# EAGLE design smartmeter (EAGLE 9.5.2)
CNAME: https://github.com/thomo/smartmeter; CREVISION: v1.0; DESIGNER: ThoMo
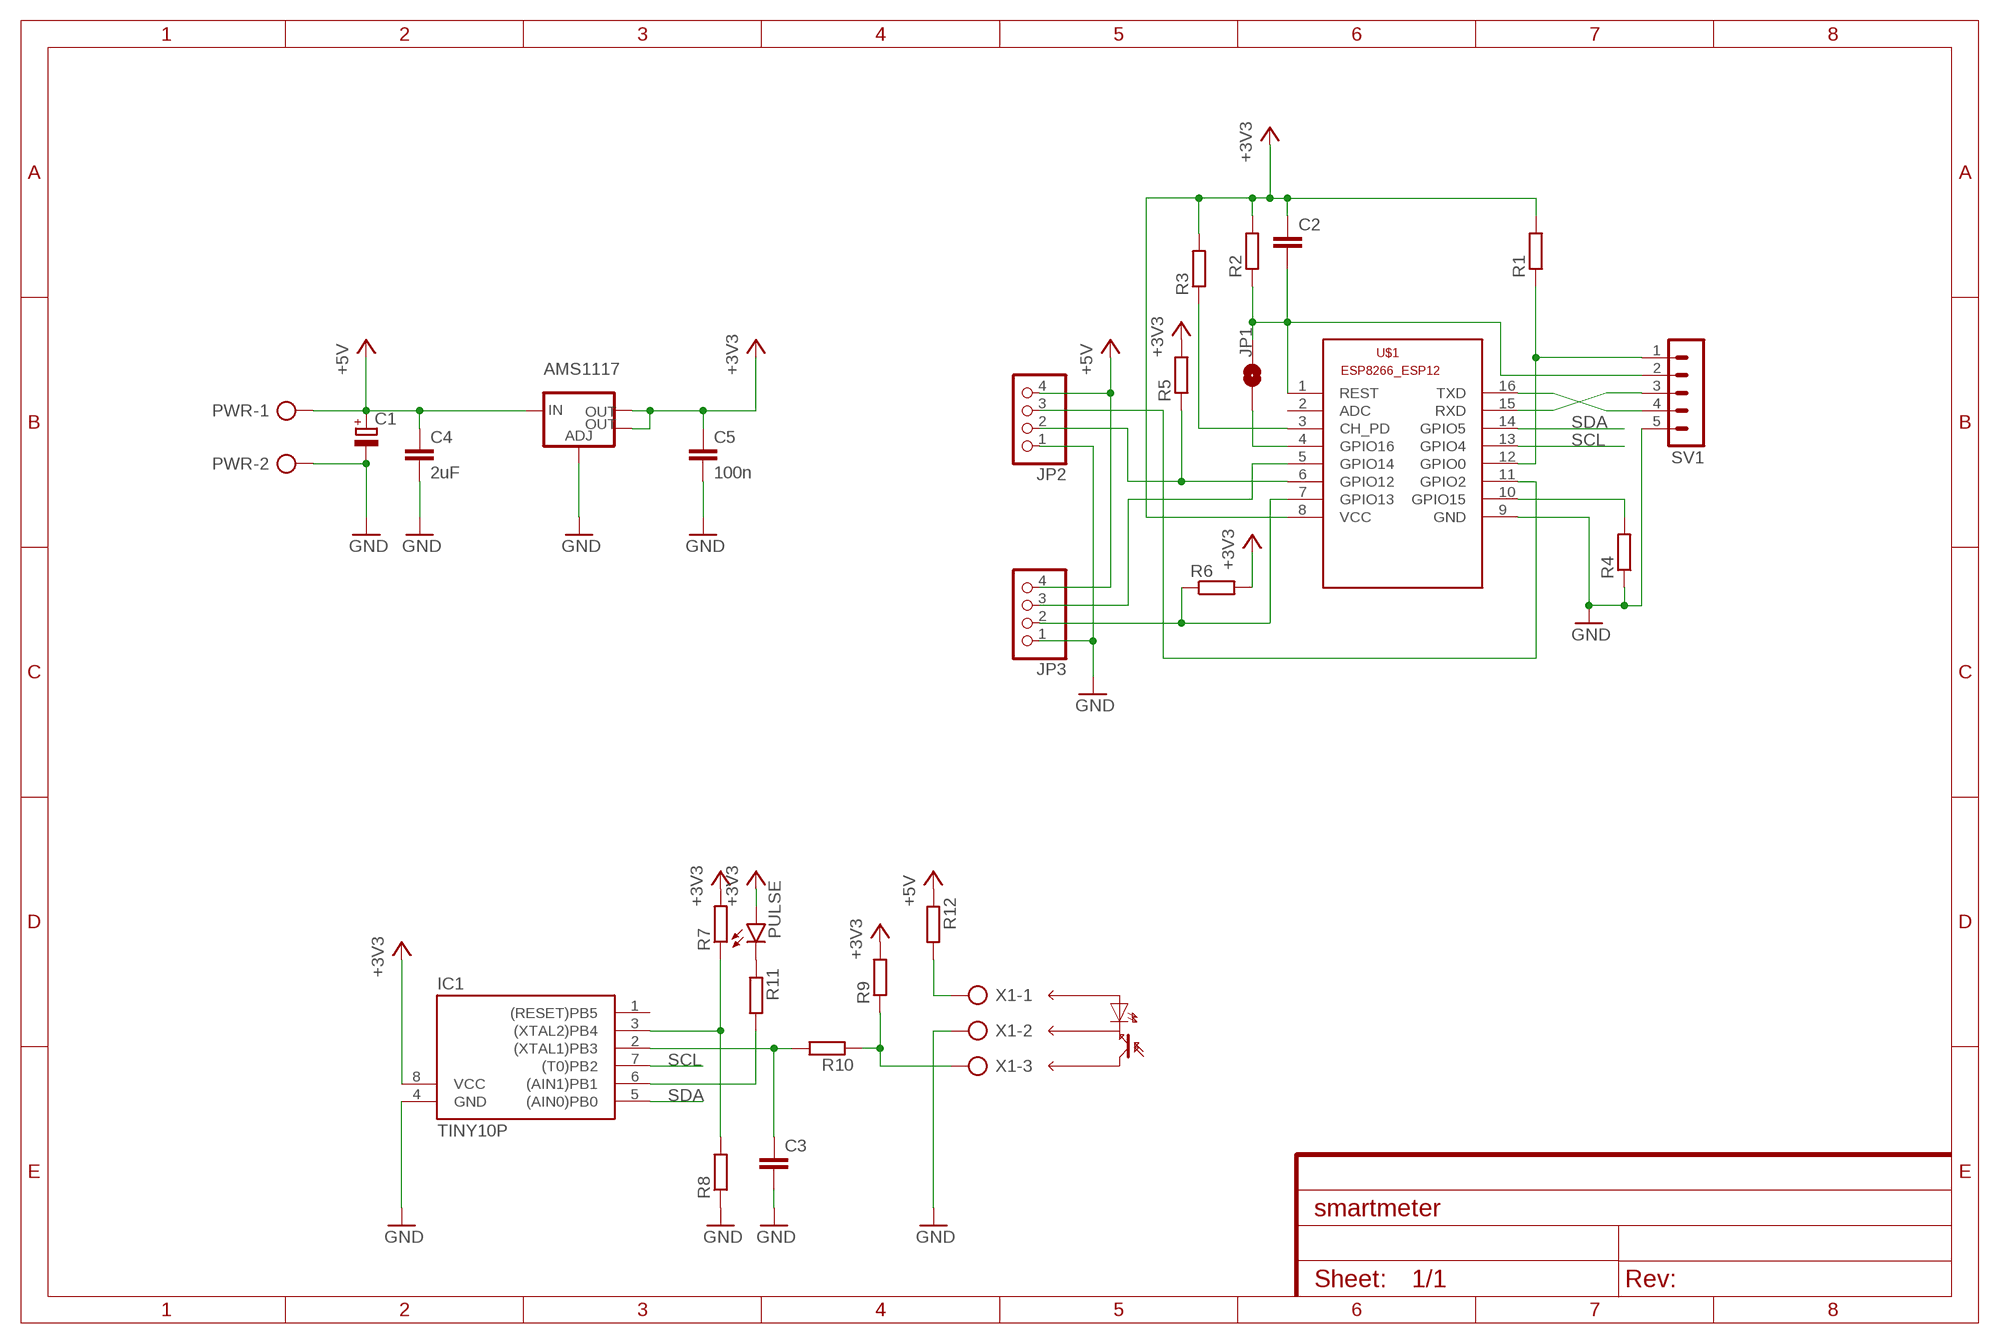
[diagram p0: schematic, sheet 1]

## Parts
AMS1117  V_REG_LM1117SOT223  [SOT223]
C1  CPOL-EUE3.5-10  [E3,5-10]
C2  C-EU050-025X075  [C050-025X075]
C3  C-EU050-025X075  [C050-025X075]
C4  2uF  C-EU025-025X050  [C025-025X050]
C5  100n  C-EU025-025X050  [C025-025X050]
IC1  TINY10P  [DIL08]
JP1  JUMPER-SMT_2_NO_SILK  [SMT-JUMPER_2_NO_SILK]
JP2  PINHD-1X4/90  [1X04/90]
JP3  PINHD-1X4/90  [1X04/90]
PULSE  LED5MM  [LED5MM]
PWR  AK500/2  [AK500/2]
R1  R-EU_0207/10  [0207/10]
R2  R-EU_0207/10  [0207/10]
R3  R-EU_0207/10  [0207/10]
R4  R-EU_0207/10  [0207/10]
R5  R-EU_0207/10  [0207/10]
R6  R-EU_0207/10  [0207/10]
R7  R-EU_0207/10  [0207/10]
R8  R-EU_0207/10  [0207/10]
R9  R-EU_0207/10  [0207/10]
R10  R-EU_0207/10  [0207/10]
R11  R-EU_0207/10  [0207/10]
R12  R-EU_0207/10  [0207/10]
SV1  MA05-1  [MA05-1]
U$1  ESP8266-12  [ESP8266-ESP12]
X1  AK500/3  [AK500/3]

## Nets
+3V3: AMS1117.2(OUT) AMS1117.4(OUT) C2.1 C5.1 IC1.8(VCC) PULSE.A R1.2 R2.2 R3.2 R5.2 R6.2 R7.2 R9.2 U$1.8(VCC)
+5V: AMS1117.3(IN) C1.+ C4.1 JP2.4 JP3.4 PWR.1 R12.1
GND: AMS1117.1(ADJ) C1.- C3.2 C4.2 C5.2 IC1.4(GND) JP2.1 JP3.1 PWR.2 R4.1 R8.1 SV1.5 U$1.9(GND) X1.2
N$1: R1.1 SV1.1 U$1.12(GPIO0)
N$2: C2.2 JP1.2 R2.1 SV1.2 U$1.1(REST)
N$3: R4.2 U$1.10(GPIO15)
N$4: JP1.1 U$1.4(GPIO16)
N$5: R3.1 U$1.3(CH_PD)
N$6: SV1.4 U$1.16(TXD)
N$7: SV1.3 U$1.15(RXD)
N$8: C3.1 IC1.2((XTAL1)PB3) R10.2
N$9: IC1.3((XTAL2)PB4) R7.1 R8.2
N$10: JP2.3 U$1.11(GPIO2)
N$11: JP2.2 R5.1 U$1.6(GPIO12)
N$12: JP3.3 U$1.5(GPIO14)
N$13: JP3.2 R6.1 U$1.7(GPIO13)
N$14: R9.1 R10.1 X1.3
N$15: IC1.6((AIN1)PB1) R11.2
N$16: PULSE.K(C) R11.1
N$17: R12.2 X1.1
SCL: IC1.7((T0)PB2) U$1.13(GPIO4)
SDA: IC1.5((AIN0)PB0) U$1.14(GPIO5)
Unconnected: IC1.1((RESET)PB5) U$1.2(ADC)

## Library data of the parts
AMS1117 = SparkFun-IC-Power:V_REG_LM1117: Voltage Regulator LM1117 Standard adjustable voltage regulator but in SMD form. Spark Fun Electronics SKU : COM-00595; PROD_ID: VREG-08170
C1 = rcl:CPOL-EU: POLARIZED CAPACITOR, European symbol; SPICEPREFIX: C
C2-C5 = rcl:C-EU: CAPACITOR, European symbol; SPICEPREFIX: C
IC1 = atmel:TINY10: MICROCONTROLLER 1 Kbytes ROM; OC_FARNELL: unknown; OC_NEWARK: unknown
JP1 = SparkFun-Jumpers:JUMPER-SMT_2_NO: Normally open jumper This jumper has two pads in close proximity to each other. Apply solder to close the connection. Round pads are easier to solder for beginners, but are a lot larger. SparkFun Product that uses the round pads: SparkFun EL Sequencer <https://www.sparkfun.com/products/12781>
JP2 JP3 = pinhead:PINHD-1X4: PIN HEADER
PULSE = led:LED: LED OSRAM: - CHIPLED LG R971, LG N971, LY N971, LG Q971, LY Q971, LO R971, LY R971 LH N974, LH R974 LS Q976, LO Q976, LY Q976 LO Q996 - Hyper CHIPLED LW Q18S LB Q993, LB Q99A, LB R99A - SideLED LS A670, LO A670, LY A670, LG A670, LP A670 LB A673, LV A673, LT A673, LW A673 LH A674 LY A675 LS A676, LA A676, LO A676, LY A676, LW A676 LS A679, LY A679, LG A679 - Hyper Micro SIDELED® LS Y876, LA Y876, LO Y876, LY Y876 LT Y87S - SmartLED LW L88C, LW L88S LB L89C, LB L89S, LG L890 LS L89K, LO L89K, LY L89K LS L896, LA L896, LO L896, LY L896 - TOPLED LS T670, LO T670, LY T670, LG T670, LP T670 LSG T670, LSP T670, LSY T670, LOP T670, LYG T670 LG T671, LOG T671, LSG T671 LB T673, LV T673, LT T673, LW T673 LH T674 LS T676, LA T676, LO T676, LY T676, LB T676, LH T676, LSB T676, LW T676 LB T67C, LV T67C, LT T67C, LS T67K, LO T67K, LY T67K, LW E67C LS E67B, LA E67B, LO E67B, LY E67B, LB E67C, LV E67C, LT E67C LW T67C LS T679, LY T679, LG T679 LS T770, LO T770, LY T770, LG T770, LP T770 LB T773, LV T773, LT T773, LW T773 LH T774 LS E675, LA E675, LY E675, LS T675 LS T776, LA T776, LO T776, LY T776, LB T776 LHGB T686 LT T68C, LB T68C - Hyper Mini TOPLED® LB M676 - Mini TOPLED Santana® LG M470 LS M47K, LO M47K, LY M47K Source: http://www.osram.convergy.de LUXEON: - LUMILED® LXK2-PW12-R00, LXK2-PW12-S00, LXK2-PW14-U00, LXK2-PW14-V00 LXK2-PM12-R00, LXK2-PM12-S00, LXK2-PM14-U00 LXK2-PE12-Q00, LXK2-PE12-R00, LXK2-PE12-S00, LXK2-PE14-T00, LXK2-PE14-U00 LXK2-PB12-K00, LXK2-PB12-L00, LXK2-PB12-M00, LXK2-PB14-N00, LXK2-PB14-P00, LXK2-PB14-Q00 LXK2-PR12-L00, LXK2-PR12-M00, LXK2-PR14-Q00, LXK2-PR14-R00 LXK2-PD12-Q00, LXK2-PD12-R00, LXK2-PD12-S00 LXK2-PH12-R00, LXK2-PH12-S00 LXK2-PL12-P00, LXK2-PL12-Q00, LXK2-PL12-R00 Source: www.luxeon.com KINGBRIGHT: KA-3528ASYC Source: www.kingbright.com
PWR = con-ptr500:AK500/2: CONNECTOR; OC_FARNELL: unknown; OC_NEWARK: unknown
R1-R12 = rcl:R-EU_: RESISTOR, European symbol; SPICEPREFIX: R
SV1 = thomo:MA05-1: PIN HEADER; OC_FARNELL: unknown; OC_NEWARK: unknown
U$1 = ESP8266-ESP12E:ESP8266-12: ESP8266-12
X1 = con-ptr500:AK500/3: CONNECTOR; OC_FARNELL: unknown; OC_NEWARK: unknown

## Board
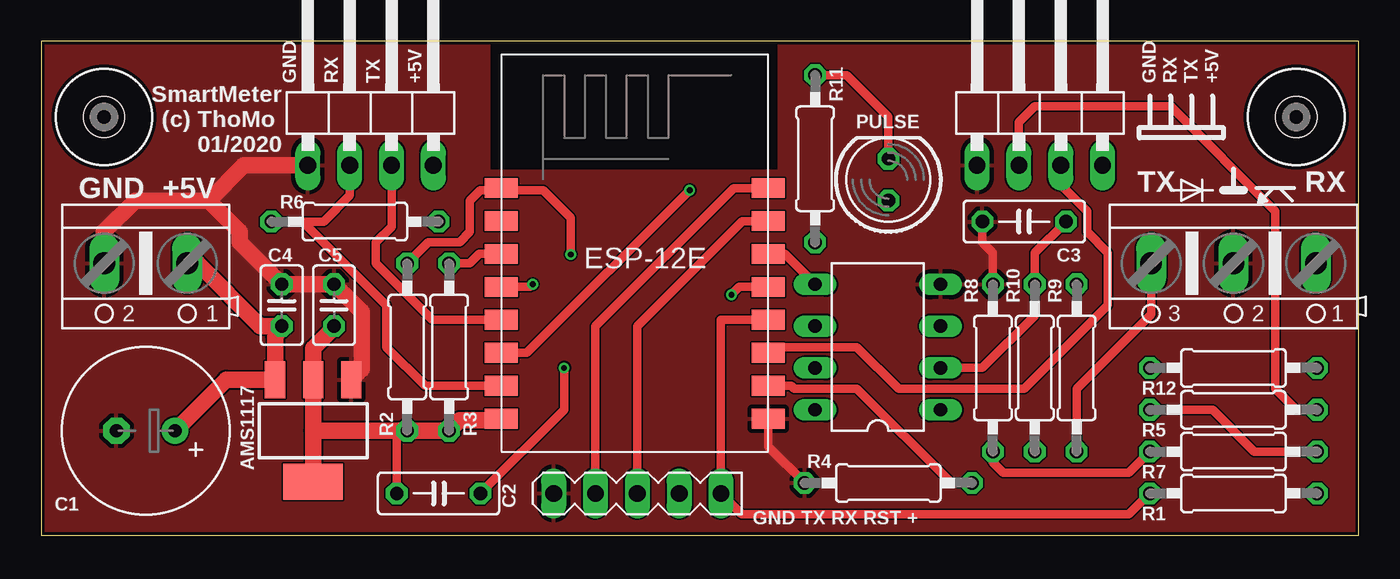
[diagram p1: board, top side]
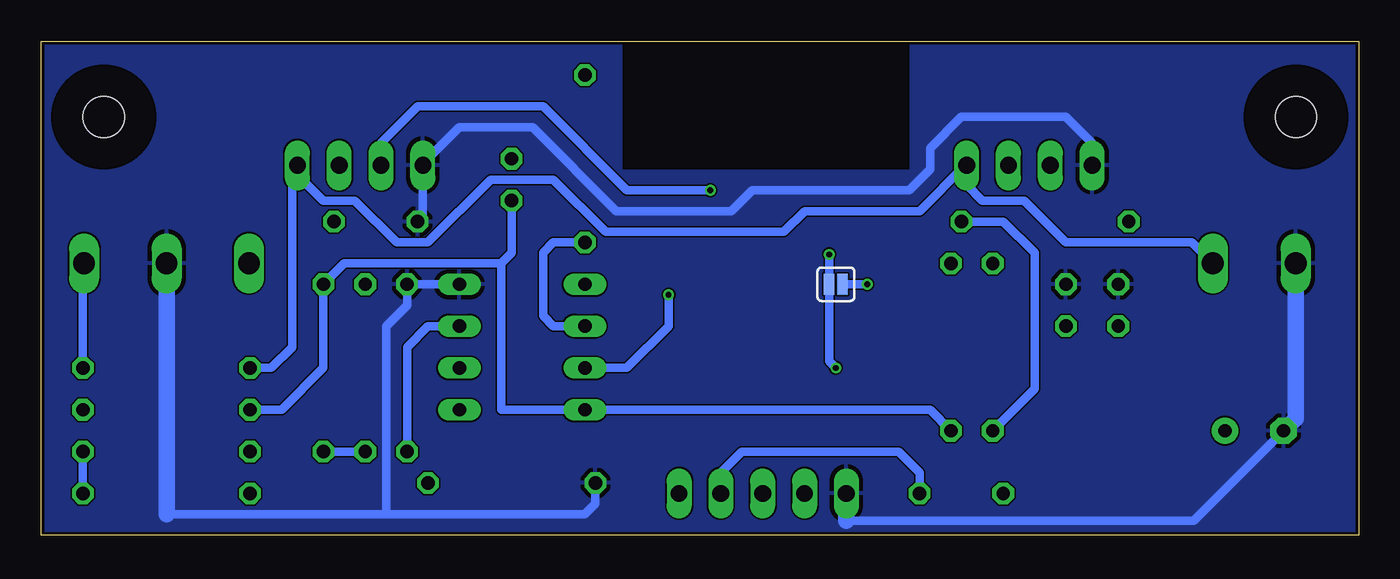
[diagram p2: board, bottom side, seen from below]

Size 80 x 30 mm. Coordinates in mm from the lower left corner, seen from the top.
Outline: 0,0 80,0 80,30 0,30 0,0
Copper layers (1*16): Top 0.035mm / dielectric 1.5mm / Bottom 0.035mm
Design rules "aisler_2_layer": minimum track width 0.1mm, minimum drill 0.2mm, track to track 0.1mm, track to pad 0.1mm, pad to pad 0.1mm, via to via 0.1mm, smd to smd 0.1mm, copper to edge 0.2mm, drill to drill 0.21mm, minimum pad ring 0.25mm, minimum via ring 0.15mm, stop-mask expansion 0mil, vias tented up to drill 0mil, thermal gap 10mil
tRestrict: area 27.3,22.2 to 44.7,30
bRestrict: area 27.3,22.2 to 44.7,30

### Footprints (pad centres in the part's own frame; a part is rotated, then mirrored left to right if it is on the bottom)
SOT223 = smd 1.219 x 2.235: 1 -2.311,-3.099; 2 0,-3.099; 3 2.311,-3.099 | smd 3.6 x 2.2: 4 0,3.099
E3,5-10 = drill 0.813 pad 1.6: + -1.778,0 | drill 0.813 pad 1.6 octagon: - 1.778,0
C050-025X075 = drill 0.813 octagon: 1 -2.54,0; 2 2.54,0
C025-025X050 = drill 0.813 octagon: 1 -1.27,0; 2 1.27,0
DIL08 = drill 0.813 long: 1 -3.81,-3.81; 2 -1.27,-3.81; 3 1.27,-3.81; 4 3.81,-3.81; 5 3.81,3.81; 6 1.27,3.81; 7 -1.27,3.81; 8 -3.81,3.81
SMT-JUMPER_2_NO_SILK = smd 0.635 x 1.27: 1 -0.406,0; 2 0.406,0
1X04/90 = drill 1.016 long: 1 -3.81,-3.81; 2 -1.27,-3.81; 3 1.27,-3.81; 4 3.81,-3.81
LED5MM = drill 0.813 octagon: A -1.27,0; K 1.27,0
AK500/2 = drill 1.321 long: 1 -2.515,0; 2 2.515,0
0207/10 = drill 0.813 octagon: 1 -5.08,0; 2 5.08,0
MA05-1 = drill 1.016 long: 1 -5.08,0; 2 -2.54,0; 3 0,0; 4 2.54,0; 5 5.08,0
ESP8266-ESP12 = smd 2 x 1.2: 1 -7.62,5.84; 2 -7.62,3.84; 3 -7.62,1.84; 4 -7.62,-0.16; 5 -7.62,-2.16; 6 -7.62,-4.16; 7 -7.62,-6.16; 8 -7.62,-8.16; 9 8.58,-8.16; 10 8.58,-6.16; 11 8.58,-4.16; 12 8.58,-2.16; 13 8.58,-0.16; 14 8.58,1.84; 15 8.58,3.84; 16 8.58,5.84
DRIL-2,5 = hole 2.5: 0,0
AK500/3 = drill 1.321 long: 1 -5.004,0; 2 0,0; 3 5.004,0

### Placement (x,y rotation side)
AMS1117  16.51,6.35 180 top
C1  6.35,6.35 180 top
C2  24.13,2.54 0 top
C3  59.69,19.05 180 top
C4  14.61,13.97 90 top
C5  17.78,13.97 90 top
IC1  50.8,11.43 90 top
JP1  31.75,15.24 180 bottom
JP2  60.63,26.27 0 top
JP3  20,26.27 0 top
PULSE  51.44,21.59 90 top
PWR  6.35,16.51 180 top
R1  72.39,2.54 0 top
R2  22.23,11.43 270 top
R3  24.77,11.43 270 top
R4  51.44,3.17 0 top
R5  72.39,7.62 180 top
R6  19.05,19.05 0 top
R7  72.39,5.08 0 top
R8  57.78,10.16 270 top
R9  62.87,10.16 90 top
R10  60.33,10.16 90 top
R11  46.99,22.86 270 top
R12  72.39,10.16 0 top
SV1  36.2,2.54 180 top
U$1  35.56,15.24 0 top
U$2  [DRIL-2,5]  3.81,25.4 0 top
U$3  [DRIL-2,5]  76.2,25.4 0 top
X1  72.39,16.51 180 top

### Tracks (layer width: path | path; a pad name or v marks a point on that pad's centre or on a via)
+3V3
  Top 0.508: C2.1 21.59,6.35 | R7.2 73.66,5.08 71.12,7.62 R5.2
  Top 1.016: 16.51,6.35 AMS1117.2 16.51,11.35 17.78,12.62 C5.1 | 16.51,6.35 AMS1117.4 | 16.51,6.35 21.59,6.35 R2.2 R3.2 25.4,6.99 27.84,6.99 U$1.8
  Bottom 0.508: R6.2 21.59,19.05 19.68,17.14 19.68,8.89 R2.2 | 52.07,16.51 52.07,7.62 IC1.8 26.04,7.62 R3.2 | 52.07,16.51 61.59,16.51 R9.2 62.87,10.16 65.41,7.62 R5.2 | 52.07,16.51 51.44,17.14 PULSE.A | R1.2 R7.2
+5V
  Top 1.016: C1.+ 11.23,9.45 AMS1117.3 14.2,12.06 C4.1 13.31,12.7 9.5,16.51 PWR.1
  Bottom 0.508: PWR.1 10.13,17.78 17.78,17.78 20.32,20.32 22.86,20.32 23.81,21.27 JP3.4 23.89,22.46 26.67,19.68 33.66,19.68 34.92,18.41 45.72,18.41 48.9,21.59 52.7,21.59 56.52,17.78 58.42,17.78 60.96,20.32 62.87,20.32 64.44,21.9 | 64.44,21.9 JP2.4 | R12.1 66.04,10.16 64.77,11.43 64.77,21.59 64.46,21.9 64.44,21.9
GND
  Top 0.508: U$1.9 44.14,5.39 R4.1 | C3.2 57.15,17.78 57.78,17.14 R8.1
  Top 1.016: 10.16,20.32 12.06,18.41 12.06,17.78 C4.2 C5.2 19.46,13.56 19.46,10.08 AMS1117.1 | PWR.2 3.81,16.54 3.81,18.41 5.71,20.32 10.16,20.32 | JP3.1 12.3,22.46 10.16,20.32
  Bottom 0.508: JP3.1 16.19,23.81 17.78,25.4 24.13,25.4 26.04,23.5 26.04,22.23 27.3,20.95 36.83,20.95 38.1,19.68 45.09,19.68 50.16,24.77 54.61,24.77 56.83,22.55 JP2.1 56.83,19.38 C3.2 | R4.1 46.35,1.91 46.99,1.27 59.05,1.27 | IC1.4 R8.1 57.78,13.97 59.05,12.7 59.05,1.27 | 31.11,0.89 10.03,0.89 C1.- | 59.05,1.27 72.39,1.27
  Bottom 1.016: C1.- 3.83,7.09 PWR.2 | 31.11,0.89 SV1.5 | 72.39,1.27 X1.2
  pour Top: 0,29.84 80.01,29.84 80.01,0 0,0
  pour Bottom: 0,29.84 0,0 80.01,0 80.01,29.84
N$1
  Top 0.508: U$1.12 41.27,13.08 SV1.1 42.55,1.27 66.04,1.27 R1.1
N$2  (via drill 0.35)
  Top 0.152: 27.94,20.95 U$1.1
  Top 0.508: R2.1 23.5,17.78 25.4,17.78 26.04,18.41 26.04,20.32 26.67,20.95 27.94,20.95 | U$1.1 28.07,20.95 30.48,20.95 32.16,19.28 v32.16,17.05 | C2.2 31.75,7.62 v31.75,10.16
  Bottom 0.508: v32.16,17.05 JP1.2 32.16,10.57 v31.75,10.16 | SV1.2 38.73,3.81 37.47,5.08 27.94,5.08 26.67,3.81 C2.2
N$3
  Top 0.508: U$1.10 45.53,9.08 45.72,8.89 49.53,8.89 55.24,3.17 R4.2
N$4  (via drill 0.35)
  Top 0.508: U$1.4 29.68,15.08 v29.84,15.24
  Bottom 0.508: JP1.1 v29.84,15.24
N$5
  Top 0.508: U$1.3 26.61,17.08 26.04,16.51 R3.1
N$6
  Top 0.508: SV1.4 33.66,12.7 42.03,21.08 U$1.16
N$7
  Top 0.508: SV1.3 36.2,12.7 42.58,19.08 U$1.15
N$8
  Top 0.508: IC1.2 57.15,10.16 60.33,13.34 R10.2 60.33,17.14 C3.1
N$9
  Top 0.508: R8.2 57.78,4.45 58.42,3.81 66.04,3.81 R7.1
  Bottom 0.508: R8.2 57.78,11.43 56.52,12.7 IC1.3
N$10
  Top 0.508: U$1.11 44.49,11.43 49.53,11.43 52.07,8.89 59.69,8.89 64.77,13.97 64.77,17.14 63.5,18.41 63.5,19.68 61.91,21.28 JP2.3
N$11  (via drill 0.35)
  Top 0.508: U$1.6 29.5,11.08 v39.37,20.95 | JP2.2 59.37,25.07 60.33,26.04 68.58,26.04 74.93,19.68 74.93,8.89 76.2,7.62 R5.1
  Bottom 0.508: v39.37,20.95 44.45,20.95 49.53,26.04 57.15,26.04 59.37,23.82 JP2.2
N$12
  Top 0.508: JP3.3 21.27,18.73 20.32,17.78 20.32,16.51 23.75,13.08 U$1.5
N$13
  Top 0.508: JP3.2 18.73,20.64 17.14,19.05 15.88,19.05 | R6.1 15.88,19.05 | U$1.7 23.3,9.08 20.95,11.43 20.95,13.97 15.88,19.05
N$14
  Top 0.508: X1.3 67.39,13.41 62.87,8.89 R9.1
  Bottom 0.508: R9.1 R10.1
N$15
  Bottom 0.508: R11.2 48.9,17.78 49.53,17.14 49.53,13.34 48.9,12.7 IC1.6
N$16
  Top 0.508: R11.1 48.9,27.94 51.44,25.4 PULSE.K
N$17
  Bottom 0.508: R12.2 77.47,16.43 X1.1
SCL  (via drill 0.35)
  Top 0.508: U$1.13 42.38,15.08 v41.91,14.61
  Bottom 0.508: v41.91,14.61 41.91,12.7 44.45,10.16 IC1.7
SDA
  Top 0.508: U$1.14 45.15,17.08 IC1.5

### Text on the board
tPlace: SmartMeter / (c) ThoMo / 01/2020 | GND | RX | TX | +5V | GND | RX | TX | +5V | TX | RX | GND | +5V | GND TX RX RST +